# Altium project TIDA-010954-RevB.PrjPcb (part 2 of 6)

## Sheet TIDA-010954-Input.SchDoc
size 431 x 279 mm; Date: Not shown in title block; ApprovedBy: Not shown in title block; CheckedBy: Not shown in title block; Author: Not shown in title block; CompanyName: Not shown in title block; Engineer: Not shown in title block; Organization: Not shown in title block; Address1: Not shown in title block; Address2: Not shown in title block; Address3: Not shown in title block; Address4: Not shown in title block; DocumentNumber: 2; Revision: Use project parameter SCH_Rev; SheetNumber: 5; SheetTotal: 9; PageSetup: Record=PageOptions|CenterHorizontal=True|CenterVertical=True|PrintScale=1.00|XCorrection=1.00|YCorrection=1.00|PrintKind=0|BorderSize=5000000|LeftOffset=0|BottomOffset=0|Orientation=2|PaperLength=1000|PaperWidth=1000|Scale=100|PaperSource=15|PrintQuality=600|MediaType=1|DitherType=10|PaperKind=Letter|PrintScaleMode=1; CurrentTime: Not shown in title block; CurrentDate: Not shown in title block; Time: Not shown in title block; DocumentFullPathAndName: Not shown in title block; DocumentName: Not shown in title block; ModifiedDate: 1/25/2022; ImagePath: Not shown in title block
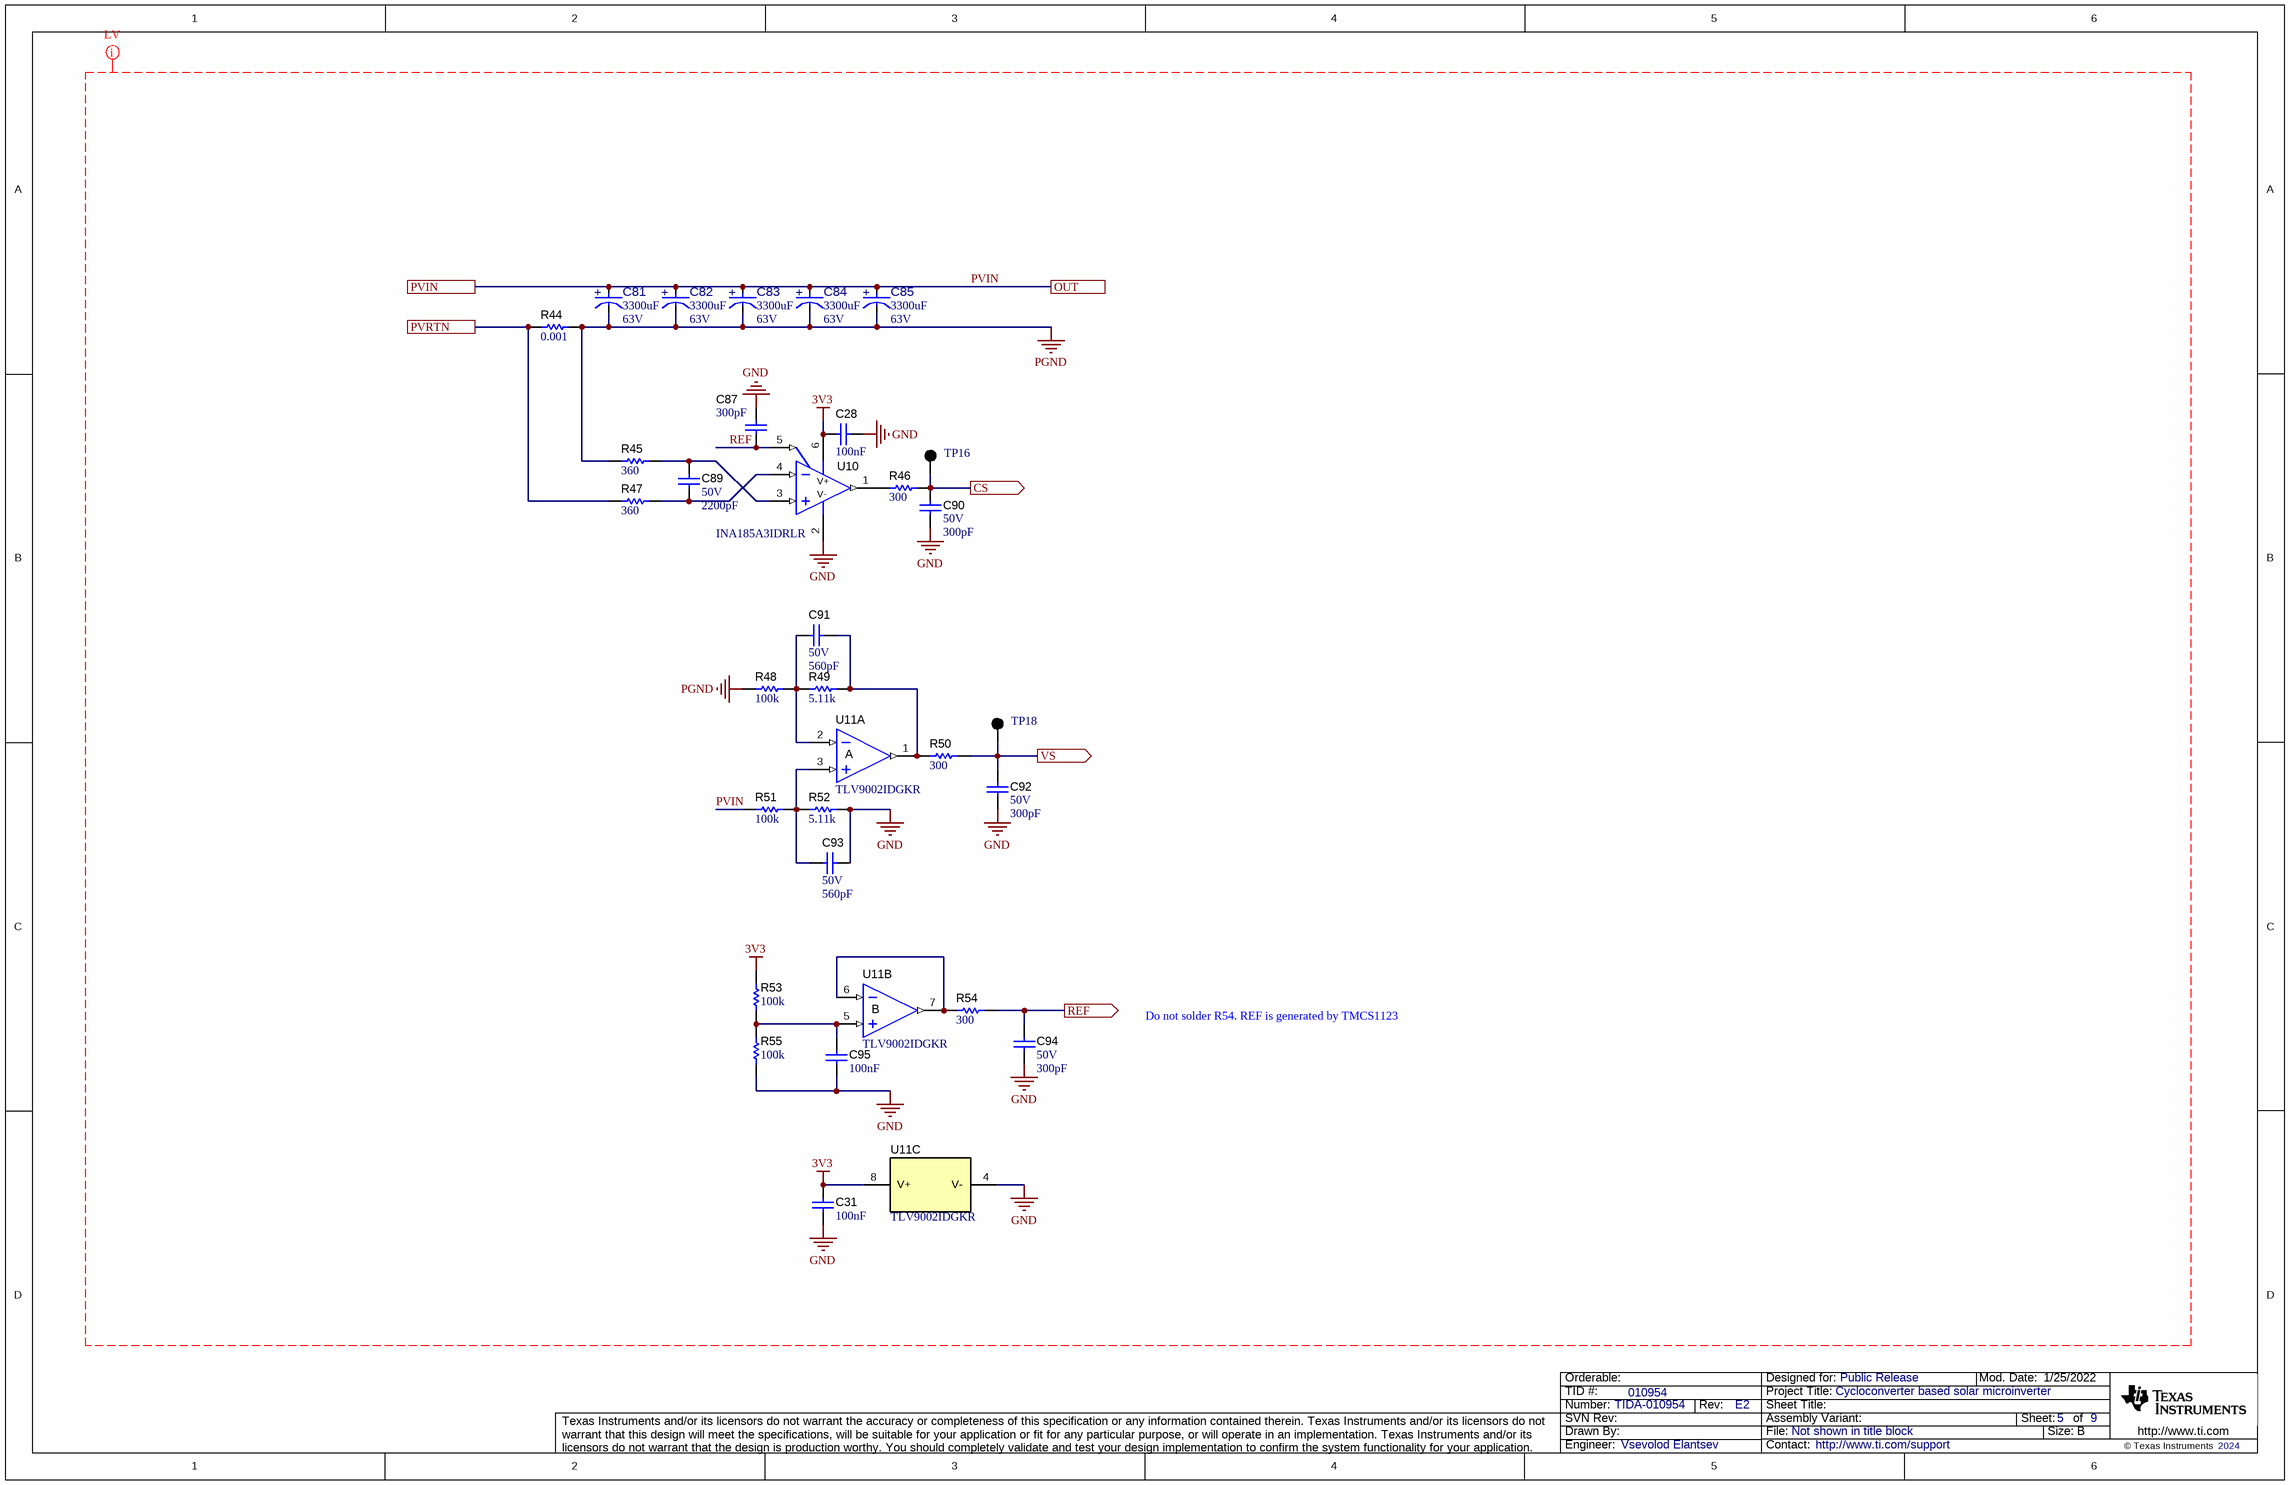
[diagram p2: TIDA-010954-Input.SchDoc]

### Parts
C28  Cap_F: 100nF  [0603]  (hidden comment: CGA3E2X7R1E104K080AA)
C31  Cap_F: 100nF  [0603]  (hidden comment: CGA3E2X7R1E104K080AA)
C81  ValueDisplayed: 3300uF  VDC_V: 63V  [FP-63ZLJ2700M18X40_RADIAL-MFG]  (hidden comment: 63ZLJ2700M18X40)
C82  ValueDisplayed: 3300uF  VDC_V: 63V  [FP-63ZLJ2700M18X40_RADIAL-MFG]  (hidden comment: 63ZLJ2700M18X40)
C83  ValueDisplayed: 3300uF  VDC_V: 63V  [FP-63ZLJ2700M18X40_RADIAL-MFG]  (hidden comment: 63ZLJ2700M18X40)
C84  ValueDisplayed: 3300uF  VDC_V: 63V  [FP-63ZLJ2700M18X40_RADIAL-MFG]  (hidden comment: 63ZLJ2700M18X40)
C85  ValueDisplayed: 3300uF  VDC_V: 63V  [FP-63ZLJ2700M18X40_RADIAL-MFG]  (hidden comment: 63ZLJ2700M18X40)
C87  ValueDisplayed: 300pF  [0603]  (hidden comment: GRM1885C1H301JA01D)
C89  VDC_V: 50V  ValueDisplayed: 2200pF  [0603]  (hidden comment: GRM1885C1H222JA01D)
C90  VDC_V: 50V  ValueDisplayed: 300pF  [0603]  (hidden comment: GRM1885C1H301JA01D)
C91  VDC_V: 50V  ValueDisplayed: 560pF  [0603]  (hidden comment: GRM1885C1H561JA01D)
C92  VDC_V: 50V  ValueDisplayed: 300pF  [0603]  (hidden comment: GRM1885C1H301JA01D)
C93  VDC_V: 50V  ValueDisplayed: 560pF  [0603]  (hidden comment: GRM1885C1H561JA01D)
C94  VDC_V: 50V  ValueDisplayed: 300pF  [0603]  (hidden comment: GRM1885C1H301JA01D)
C95  Cap_F: 100nF  [0603]  (hidden comment: CGA3E2X7R1E104K080AA)
R44  ValueDisplayed: 0.001  [1206]  (hidden comment: CRF1206-FZ-R001ELF)
R45  ValueDisplayed: 360  [0603]  (hidden comment: RC0603JR-07360RL)
R46  ValueDisplayed: 300  [0603]  (hidden comment: RC0603FR-07300RL)
R47  ValueDisplayed: 360  [0603]  (hidden comment: RC0603JR-07360RL)
R48  ValueDisplayed: 100k  [0603]  (hidden comment: RT0603BRD07100KL)
R49  ValueDisplayed: 5.11k  [0603]  (hidden comment: RT0603BRD075K11L)
R50  ValueDisplayed: 300  [0603]  (hidden comment: RC0603FR-07300RL)
R51  ValueDisplayed: 100k  [0805_HV]  (hidden comment: RT0805BRD07100KL)
R52  ValueDisplayed: 5.11k  [0603]  (hidden comment: RT0603BRD075K11L)
R53  ValueDisplayed: 100k  [0603]  (hidden comment: RT0603BRD07100KL)
R54  ValueDisplayed: 300  [0603]  (hidden comment: RC0603FR-07300RL)
R55  ValueDisplayed: 100k  [0603]  (hidden comment: RT0603BRD07100KL)
TP16  5011  [Keystone5011]  (value not drawn)
TP18  5011  [Keystone5011]  (value not drawn)
U10  INA185A3IDRLR  [DRL0006A]
U11  TLV9002IDGKR  [DGK0008A_N]  (parts A,B,C of 3)

### Ports
CS (out), OUT, PVIN, PVRTN, REF (out), VS (out)

### Nets
3V3: C28.1 C31.2 R53.1 U10.6(V+) U11.8(V+)
GND: C28.2 C31.1 C87.2 C90.2 C92.2 C93.1 C94.2 C95.1 R52.2 R55.2 U10.2(V-) U11.4(V-)
PGND: C81.1(CATHODE) C82.1(CATHODE) C83.1(CATHODE) C84.1(CATHODE) C85.1(CATHODE) R44.2 R45.1 R48.1
DC_CS: C90.1 R46.1 TP16.1 ; port CS
DC_VS: C92.1 R50.1 TP18.1 ; port VS
PVIN: C81.2(ANODE) C82.2(ANODE) C83.2(ANODE) C84.2(ANODE) C85.2(ANODE) R51.1 ; port PVIN, port OUT
PVRTN: R44.1 R47.1 ; port PVRTN
REF: C94.1 R54.1 ; port REF
REF: C87.1 U10.5(REF)  [a separate net that carries the same name]
NetC89_1: C89.1 R45.2 U10.3(IN+)
NetC89_2: C89.2 R47.2 U10.4(IN-)
NetC91_1: C91.1 R49.2 R50.2 U11.1(OUT)
NetC91_2: C91.2 R48.2 R49.1 U11.2(IN-)
NetC93_2: C93.2 R51.2 R52.1 U11.3(IN+)
NetC95_2: C95.2 R53.2 R55.1 U11.5(IN+)
NetR46_2: R46.2 U10.1(OUT)
NetR54_2: R54.2 U11.6(IN-) U11.7(OUT)

### Layout directives
net class LV: 3V3, GND, PGND, PVIN, REF

### Notes on the sheet
- Do not solder R54. REF is generated by TMCS1123
- Drawn By:
- SVN Rev:
- Number:
- TID #:
- Orderable:
- Rev:
- Sheet Title:
- File:
- Project Title:
- Designed for:
- Assembly Variant:
- Mod. Date:
- Sheet:
- Size:
- of
- B
- http://www.ti.com
- Texas Instruments and/or its licensors do not warrant the accuracy or completeness of this specification or any information contained therein. Texas Instruments and/or its licensors do not warrant that this design will meet the specifications, will be suitable for your application or fit for any particular purpose, or will operate in an implementation. Texas Instruments and/or its licensors do not warrant that the design is production worthy. You should completely validate and test your design implementation to confirm the system functionality for your application.
- Engineer:
- Contact:
- © Texas Instruments
- (in symbol CMP-0073533-3, part A) A
- (in symbol CMP-0073533-3, part B) B
- (in symbol CMP-0122849-1) +

### Library data of the parts
C28 C31 C95 = CMP-0007077-5: as C45 on sheet TIDA-010954-Power; Supplier Part Number 2: 79Y4100; Publisher: Texas Instruments; Supplier 2: Newark; Supplier Part Number 3: 810-CGA3E2X7R1E104K; TempCo: X7R; Supplier 3: Mouser; Published: 2008-06-19; RoHS: Y; MountType: SMT; Supplier 1: Digi-Key; PackageReference: 0603; Tolerance_%: 10%; Cap_Case: 0603; CompType: Capacitor; LatestRevisionDate: 2017-03-09; PartNumber: CGA3E2X7R1E104K080AA; VDC_V: 25V; ComponentLink1Description: Datasheet link; AEC Grade: 1; Supplier Part Number 1: 445-5667-1-ND; Technology: Ceramic; ValueDisplayed: 0.1uF; ComponentLink1URL: https://product.tdk.com/info/en/documents/chara_sheet/CGA3E2X7R1E104K080AA.pdf
C81-C85 = CMP-0122849-1: 2700 µF 63 V Aluminum Electrolytic Capacitors Radial, Can 10000 Hrs @ 105°C; Manufacturer: Rubycon; Part Number: 63PK3300MEFC18X40; AEC Qualified: No; Cap_F: 2.7mF; IRMS_A: 4.3A; SizeZ_mm: 42mm; Tolerance_%: 20%; Dissipation Factor: 9%; Leakage Current: 1701uA; Life: 10000Hours; Value: 2.7mF; PackageReference: RADIAL; PartNumber: 63ZLJ2700M18X40; RoHS: TRUE; Supplier 1: Digikey; Supplier 2: Mouser; Supplier Part Number 1: 1189-4111-ND; Supplier Part Number 2: 232-63ZLJ2700M18X40; datasheet: https://www.rubycon.co.jp/wp-content/uploads/catalog-aluminum/ZLJ.pdf; Datasheet Path: datasheets/Cap-63ZLJ2700M18X40.pdf; Digikey Description: CAP ALUM 2700UF 20% 63V RADIAL; Digikey Part Number: 1189-4111-ND; helpURL: https://upverter.com/upn/revision/aed06e7c5360b1c1/; Lead Free: Yes; Mouser Part Number: 232-63ZLJ2700M18X40; Operating Temperature Range: -40°C to +105°C; ComponentLink1Description: Datasheet; ComponentLink1URL: https://www.rubycon.co.jp/wp-content/uploads/catalog-aluminum/ZLJ.pdf
C87 = CMP-0007206-4: CAP, CERM, 300 pF, 50 V, +/- 5%, C0G/NP0, 0603; Manufacturer: MuRata; TaMin_C: -55°C; Polarized: N; SizeAreaWB_mm2: 4.68; Value1: Unknown; U/M: EA; Value: 300pF; TaMax_C: 125°C; SizeZ_mm: 1; SizeX_mm: 1.6; SizeY_mm: 0.8; Value2: 50V; SizeArea_mm2: 1.28; AEC Category: Q200; Supplier Part Number 2: 81-GRM185C1H301JA01D; Publisher: Texas Instruments; Supplier 2: Mouser; TempCo: C0G/NP0; Published: 2008-06-19; RoHS: Y; MountType: SMT; Supplier 1: Digi-Key; PackageReference: 0603; Tolerance_%: 5%; Cap_Case: 0603; CompType: Capacitor; LatestRevisionDate: 2017-03-09; PartNumber: GRM1885C1H301JA01D; AEC Qualified: ?; Cap_F: 300pF; VDC_V: 50V; ComponentLink1Description: Datasheet link; Supplier Part Number 1: 490-1438-1-ND; Technology: Ceramic; ComponentLink1URL: http://search.murata.co.jp/Ceramy/PnsearchViewAction.do?HnOFG=ON&HnNFG=ON&SEL_CNT=50&sLang=en&sKey=GRM1885C1H301JA01D&x=9&y=9&search=startwith
C89 = CMP-0007198-4: CAP, CERM, 2200 pF, 50 V, +/- 5%, C0G/NP0, 0603; Manufacturer: MuRata; TaMin_C: -55°C; Polarized: N; SizeAreaWB_mm2: 4.68; Value1: Unknown; U/M: EA; Value: 2200pF; TaMax_C: 125°C; SizeZ_mm: 1; SizeX_mm: 1.6; SizeY_mm: 0.8; SizeArea_mm2: 1.28; Cap_F: 2.2nF; AEC Category: Q200; Supplier Part Number 2: 81-GRM1885C1H222JA01; Publisher: Texas Instruments; Supplier 2: Mouser; Supplier Part Number 3: 8819947; TempCo: C0G/NP0; Supplier 3: Farnell; Published: 2008-06-19; RoHS: Y; MountType: SMT; Supplier 1: Digi-Key; PackageReference: 0603; Tolerance_%: 5%; Cap_Case: 0603; Value2: 50V; CompType: Capacitor; LatestRevisionDate: 2017-03-09; PartNumber: GRM1885C1H222JA01D; AEC Qualified: ?; ComponentLink1Description: Datasheet link; Supplier Part Number 1: 490-1459-1-ND; Technology: Ceramic; ComponentLink1URL: http://search.murata.co.jp/Ceramy/PnsearchViewAction.do?HnOFG=ON&HnNFG=ON&SEL_CNT=50&sLang=en&sKey=GRM1885C1H222JA01D&x=9&y=9&search=startwith
C90 C92 C94 = CMP-0007206-4: CAP, CERM, 300 pF, 50 V, +/- 5%, C0G/NP0, 0603; Manufacturer: MuRata; TaMin_C: -55°C; Polarized: N; SizeAreaWB_mm2: 4.68; Value1: Unknown; U/M: EA; Value: 300pF; TaMax_C: 125°C; SizeZ_mm: 1; SizeX_mm: 1.6; SizeY_mm: 0.8; SizeArea_mm2: 1.28; AEC Category: Q200; Supplier Part Number 2: 81-GRM185C1H301JA01D; Publisher: Texas Instruments; Supplier 2: Mouser; TempCo: C0G/NP0; Published: 2008-06-19; RoHS: Y; MountType: SMT; Supplier 1: Digi-Key; PackageReference: 0603; Tolerance_%: 5%; Cap_Case: 0603; Value2: 50V; CompType: Capacitor; LatestRevisionDate: 2017-03-09; PartNumber: GRM1885C1H301JA01D; AEC Qualified: ?; Cap_F: 300pF; ComponentLink1Description: Datasheet link; Supplier Part Number 1: 490-1438-1-ND; Technology: Ceramic; ComponentLink1URL: http://search.murata.co.jp/Ceramy/PnsearchViewAction.do?HnOFG=ON&HnNFG=ON&SEL_CNT=50&sLang=en&sKey=GRM1885C1H301JA01D&x=9&y=9&search=startwith
C91 C93 = CMP-0007225-4: CAP, CERM, 560 pF, 50 V, +/- 5%, C0G/NP0, 0603; Manufacturer: MuRata; TaMin_C: -55°C; Polarized: N; SizeAreaWB_mm2: 4.68; Value1: Unknown; U/M: EA; Value: 560pF; TaMax_C: 125°C; SizeZ_mm: 1; SizeX_mm: 1.6; SizeY_mm: 0.8; SizeArea_mm2: 1.28; AEC Category: Q200; Supplier Part Number 2: 81-GRM39C561J50; Publisher: Texas Instruments; Supplier 2: Mouser; Supplier Part Number 3: 1828912; TempCo: C0G/NP0; Supplier 3: Farnell; Published: 2008-06-19; RoHS: Y; MountType: SMT; Supplier 1: Digi-Key; PackageReference: 0603; Tolerance_%: 5%; Cap_Case: 0603; Value2: 50V; CompType: Capacitor; LatestRevisionDate: 2017-03-09; PartNumber: GRM1885C1H561JA01D; AEC Qualified: ?; Cap_F: 560pF; ComponentLink1Description: Datasheet link; Supplier Part Number 1: 490-1445-1-ND; Technology: Ceramic; ComponentLink1URL: http://search.murata.co.jp/Ceramy/PnsearchViewAction.do?HnOFG=ON&HnNFG=ON&SEL_CNT=50&sLang=en&sKey=GRM1885C1H561JA01D&x=9&y=9&search=startwith
R44 = CMP-0078821-1: RES, 0.001, 1%, 1 W, AEC-Q200 Grade 0, 1206; Manufacturer: Bourns; Value_Code: 1L000; SizeArea_mm2: 5.12; AEC Qualified: Y; AEC Category: Q200; Res_ohm: 1m; Value: 0.001; SizeZ_mm: 1.35; EIA_Code: E96; TempCo: 50 ppm/C; AEC Grade: 0; SizeY_mm: 1.6; Power_W: 1W; SizeX_mm: 3.2; ComponentLink1Description: Datasheet link; RoHS: Y; Tolerance_%: 1%; PackageReference: 1206; Technology: Metal Film; PartNumber: CRF1206-FZ-R001ELF; Value2: 1W; ComponentLink1URL: http://www.bourns.com/docs/Product-Datasheets/crf.pdf; Value1: 1%; CompType: Resistor; MountType: SMT
R45 R47 = CMP-0025914-5: RES, 360, 5%, 0.1 W, 0603; Manufacturer: Yageo; Power_W: 100mW; TempCo: 100 ppm/C; Value_Code: 360R; Value: 360; EIA_Code: E24; SizeX_mm: 1.6; SizeY_mm: 0.8; SizeZ_mm: 1; Value2: 0.1W; SizeArea_mm2: 1.28; AEC Qualified: N; VDC_V: 75V; AEC Category: Q200; SizeAreaWB_mm2: 4.68; Supplier Part Number 2: 603-RC0603JR-07360RL; Supplier 2: Mouser; RoHS: Y; Value1: 5%; MountType: SMT; Supplier 1: Digi-Key; PackageReference: 0603; Tolerance_%: 5%; Res_ohm: 360; CompType: Resistor; PartNumber: RC0603JR-07360RL; ComponentLink1Description: Datasheet link; Supplier Part Number 1: 311-360GRCT-ND; Technology: Thick Film; ComponentLink1URL: http://www.yageo.com/pdf/Pu-RC0603_51_PbFree_L_2.pdf; AEC Grade: N/A
R46 R50 R54 = CMP-0023013-5: RES, 300, 1%, 0.1 W, 0603; Manufacturer: Yageo; Power_W: 100mW; TempCo: 100 ppm/C; Value_Code: 300R; Value: 300; SizeX_mm: 1.6; SizeY_mm: 0.8; SizeZ_mm: 1; Value2: 0.1W; SizeArea_mm2: 1.28; AEC Qualified: N; VDC_V: 75V; AEC Category: Q200; SizeAreaWB_mm2: 4.68; Supplier Part Number 2: 603-RC0603FR-07300RL; Supplier 2: Mouser; Supplier Part Number 3: 1799340; Supplier 3: Farnell; RoHS: Y; Value1: 1%; MountType: SMT; Supplier 1: Digi-Key; PackageReference: 0603; Tolerance_%: 1%; Res_ohm: 300; CompType: Resistor; PartNumber: RC0603FR-07300RL; ComponentLink1Description: Datasheet link; Supplier Part Number 1: 311-300HRCT-ND; Technology: Thick Film; ComponentLink1URL: http://www.yageo.com/pdf/Pu-RC0603_51_PbFree_L_2.pdf; AEC Grade: N/A
R48 R53 R55 = CMP-0023630-3: RES, 100 k, 0.1%, 0.1 W, 0603; Manufacturer: Yageo America; Power_W: 100mW; TempCo: 25 ppm/C; U/M: EA; Value: 100k; EIA_Code: E192; SizeX_mm: 1.6; SizeY_mm: 0.8; SizeZ_mm: 1; Value2: 0.1W; SizeArea_mm2: 1.28; VDC_V: 75V; AEC Category: Q200; Publisher: Texas Instruments; Published: 2008-06-26; Value_Code: 100k; RoHS: Y; Value1: 0.1%; MountType: SMT; Supplier 1: Mouser; PackageReference: 0603; Tolerance_%: 0.1%; Res_ohm: 100k; CompType: Resistor; LatestRevisionDate: 2017-03-09; PartNumber: RT0603BRD07100KL; AEC Qualified: ?; ComponentLink1Description: Datasheet link; Supplier Part Number 1: 603-RT0603BRD07100KL; Technology: Thin Film; ComponentLink1URL: http://www.yageo.com/pdf/PYu-RT_1-to-0.05_RoHS_L_3.pdf
R49 R52 = CMP-0024366-2: RES, 5.11 k, 0.1%, 0.1 W, 0603; Manufacturer: Yageo America; Power_W: 100mW; TempCo: 25 ppm/C; Value_Code: 5k11; U/M: EA; Value: 5.11k; EIA_Code: E192; SizeX_mm: 1.6; SizeY_mm: 0.8; SizeZ_mm: 1; Value2: 0.1W; SizeArea_mm2: 1.28; VDC_V: 75V; AEC Category: Q200; ComponentLink1URL: http://www.yageo.com/pdf/PYu-RT_1-to-0.05_RoHS_L_3.pdf; Publisher: Texas Instruments; Published: 2008-06-26; RoHS: Y; Value1: 0.1%; MountType: SMT; PackageReference: 0603; Tolerance_%: 0.1%; Res_ohm: 5.11k; CompType: Resistor; LatestRevisionDate: 2017-03-09; PartNumber: RT0603BRD075K11L; AEC Qualified: ?; ComponentLink1Description: Datasheet link; Technology: Thin Film
R51 = CMP-0019441-2: RES, 100 k, 0.1%, 0.125 W, 0805; Manufacturer: Yageo America; Power_W: 125mW; TempCo: 25 ppm/C; U/M: EA; Value: 100k; EIA_Code: E192; SizeX_mm: 2; SizeY_mm: 1.25; SizeZ_mm: 1.45; Value2: 0.125W; SizeArea_mm2: 2.5; VDC_V: 150V; AEC Category: Q200; Publisher: Texas Instruments; Published: 2008-06-26; Value_Code: 100k; RoHS: Y; Value1: 0.1%; MountType: SMT; PackageReference: 0805; Tolerance_%: 0.1%; Res_ohm: 100k; CompType: Resistor; LatestRevisionDate: 2017-03-09; PartNumber: RT0805BRD07100KL; AEC Qualified: ?; ComponentLink1Description: Datasheet link; Technology: Thin Film; ComponentLink1URL: http://www.yageo.com/pdf/PYu-RT_1-to-0.05_RoHS_L_3.pdf
TP16 TP18 = CMP-0055148-2: as TP4 on sheet TIDA-010954-Top; ComponentLink1Description: Datasheet URL; Supplier 1: Digi-Key; MountType: TH; Supplier 2: Mouser; LatestRevisionDate: 26/05/2017; Publisher: Texas Instruments; PartNumber: 5011; Color: Black; ComponentLink1URL: http://www.keyelco.com/userAssets/file/M60-2p60.pdf; Green_EU RoHS-2: Incomplete; Supplier Part Number 1: 36-5011-ND; Supplier Part Number 2: 534-5011; Green_EU RoHS: Passed; RoHS: Y; PackageReference: Black Multipurpose Testpoint; CompType: Test Point
U10 = CMP-0085240-1: Bidirectional, Precision Low- and High-Side Voltage Output, Current-Sense Amplifier, DRL0006A (SOT-5X3-6); Alternate Manufacturer: Texas Instruments; Alternate PartNumber: INA185A3IDRLT; SizeAreaWB_mm2: 6.76; SizeY_mm: 1.6; CompType: IC; SizeZ_mm: 0.6; AEC Category: Q200; SizeArea_mm2: 2.56; AEC Qualified: N; ComponentLink2URL: http://www.ti.com/product/ina185; MountType: SMT; ComponentLink1URL: http://www.ti.com/lit/ds/symlink/ina185.pdf; ComponentLink3Description: Online Datasheet; ComponentLink1Description: Datasheet Link; ComponentLink2Description: Product Folder; Manufacturer: Texas Instruments; PackageReference: DRL0006A; PartNumber: INA185A3IDRLR; ComponentLink3URL: http://www.ti.com/product/ina185/datasheet; SizeX_mm: 1.6; PackageDescription: SOT-5X3-6
U11 = CMP-0073533-3: Alternate PartNumber: TLV2333IDGKT; Alternate Manufacturer: Texas Instruments; SizeAreaWB_mm2: 23.6; SizeZ_mm: 1.1; SizeX_mm: 4.9; SizeY_mm: 3; SizeArea_mm2: 14.7; CompType: IC; AEC Category: Q200; AEC Qualified: N; ComponentLink1URL: http://www.ti.com/lit/ds/symlink/tlv2333.pdf; PackageDescription: VSSOP-8; RoHS: Y; MountType: SMT; Manufacturer: Texas Instruments; PackageReference: DGK0008A; PartNumber: TLV9002IDGKR; ComponentLink1Description: Datasheet Link; ComponentLink2Description: Product Folder; ComponentLink2URL: http://www.ti.com/product/tlv2333; ComponentLink3Description: Online Datasheet; ComponentLink3URL: http://www.ti.com/product/tlv2333/datasheet; Code_JEDEC: MO-187-AA

## Sheet TIDA-010954-Output.SchDoc
size 431 x 279 mm; Date: Not shown in title block; ApprovedBy: Not shown in title block; CheckedBy: Not shown in title block; Author: Not shown in title block; CompanyName: Not shown in title block; Engineer: Not shown in title block; Organization: Not shown in title block; Address1: Not shown in title block; Address2: Not shown in title block; Address3: Not shown in title block; Address4: Not shown in title block; DocumentNumber: 2; Revision: Use project parameter SCH_Rev; SheetNumber: 7; SheetTotal: 9; PageSetup: Record=PageOptions|CenterHorizontal=True|CenterVertical=True|PrintScale=1.00|XCorrection=1.00|YCorrection=1.00|PrintKind=0|BorderSize=5000000|LeftOffset=0|BottomOffset=0|Orientation=2|PaperLength=1000|PaperWidth=1000|Scale=100|PaperSource=15|PrintQuality=600|MediaType=1|DitherType=10|PaperKind=Letter|PrintScaleMode=1; CurrentTime: Not shown in title block; CurrentDate: Not shown in title block; Time: Not shown in title block; DocumentFullPathAndName: Not shown in title block; DocumentName: Not shown in title block; ModifiedDate: 1/25/2022; ImagePath: Not shown in title block
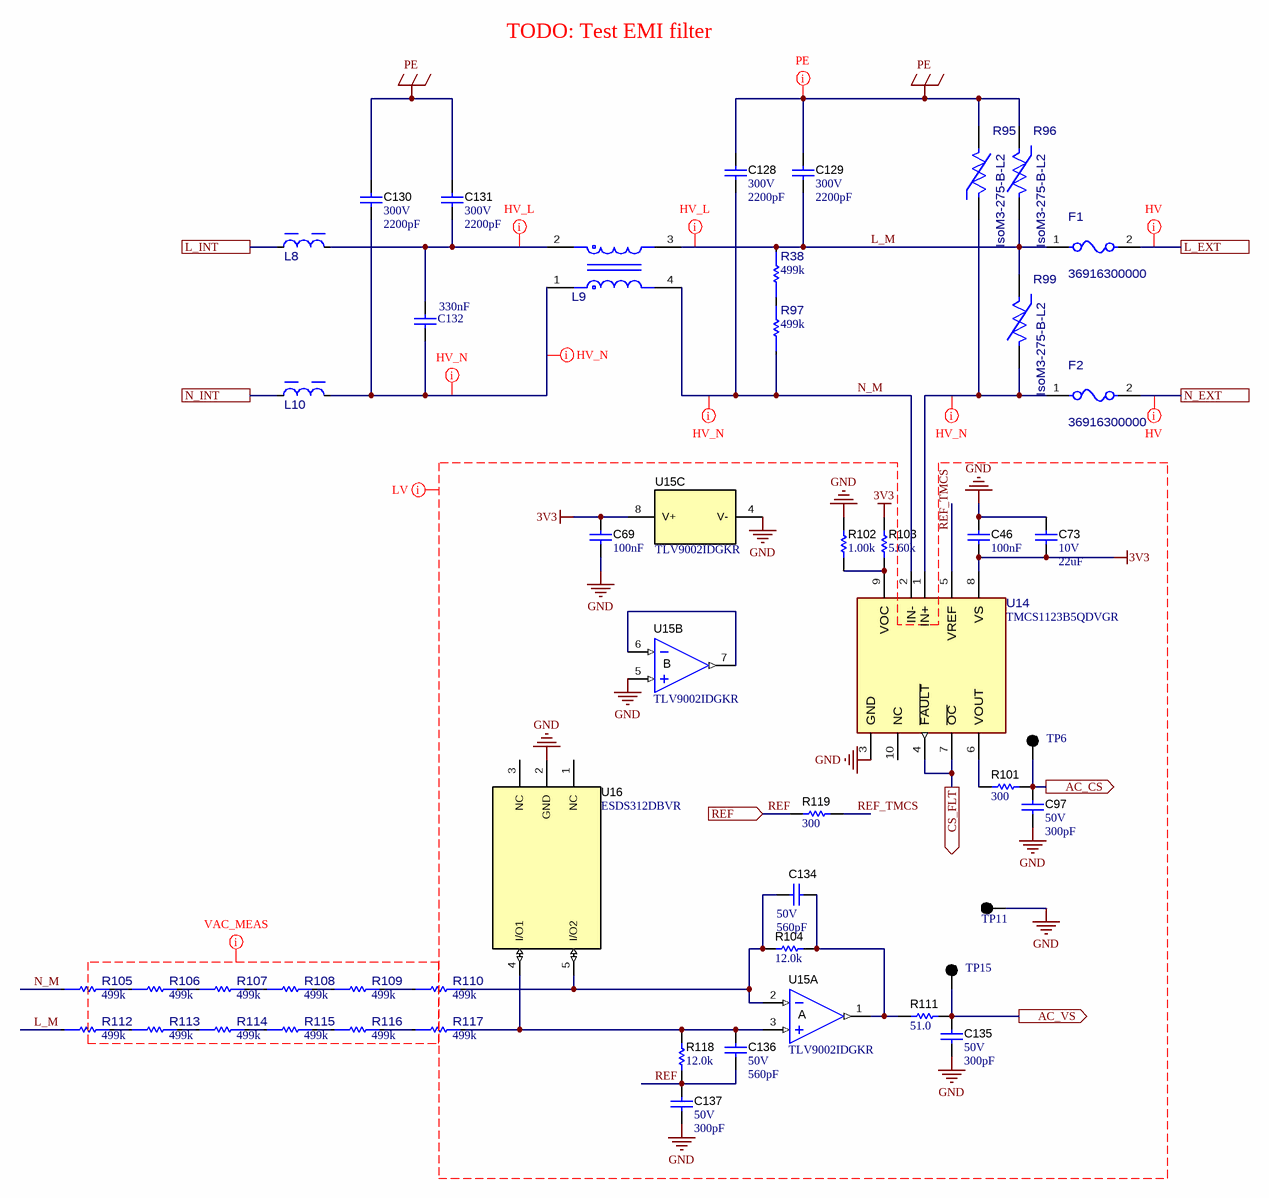
[diagram p3: TIDA-010954-Output.SchDoc]

### Parts
C46  Cap_F: 100nF  [0603]  (hidden comment: CGA3E2X7R1E104K080AA)
C69  Cap_F: 100nF  [0603]  (hidden comment: CGA3E2X7R1E104K080AA)
C73  VDC_V: 10V  ValueDisplayed: 22uF  [1206_180]  (hidden comment: GRM31CR71A226KE15L)
C97  VDC_V: 50V  ValueDisplayed: 300pF  [0603]  (hidden comment: GRM1885C1H301JA01D)
C128  VDC_V: 300V  ValueDisplayed: 2200pF  [E_900x700x900]  (hidden comment: DE6E3KJ222MN3A)
C129  VDC_V: 300V  ValueDisplayed: 2200pF  [E_900x700x900]  (hidden comment: DE6E3KJ222MN3A)
C130  VDC_V: 300V  ValueDisplayed: 2200pF  [E_900x700x900]  (hidden comment: DE6E3KJ222MN3A)
C131  VDC_V: 300V  ValueDisplayed: 2200pF  [E_900x700x900]  (hidden comment: DE6E3KJ222MN3A)
C132  Cap_F: 330nF  [WCAP-FTX2_L18W8.5H14.5_CS]  (hidden comment: 890324025034CS)
C134  VDC_V: 50V  ValueDisplayed: 560pF  [0603]  (hidden comment: GRM1885C1H561JA01D)
C135  VDC_V: 50V  ValueDisplayed: 300pF  [0603]  (hidden comment: GRM1885C1H301JA01D)
C136  VDC_V: 50V  ValueDisplayed: 560pF  [0603]  (hidden comment: GRM1885C1H561JA01D)
C137  VDC_V: 50V  ValueDisplayed: 300pF  [0603]  (hidden comment: GRM1885C1H301JA01D)
F1  36916300000  [FP-36916300000_RADIAL-MFG]
F2  36916300000  [FP-36916300000_RADIAL-MFG]
L8  7443551221  [FP-7443551221_SMD_IND_12MM8_12MM8-MFG]  (value not drawn)
L9  7448025003  [FP-7448025003_PTH_COMMON_CHOKE-MFG]  (value not drawn)
L10  7443551221  [FP-7443551221_SMD_IND_12MM8_12MM8-MFG]  (value not drawn)
R38  value 499k  [FP-ERJP08D4993V_1206-MFG]  (hidden comment: ERJP08D4993V)
R95  IsoM3-275-B-L2  [FP-IsoM3-275-B-L2_RADIAL-MFG]
R96  IsoM3-275-B-L2  [FP-IsoM3-275-B-L2_RADIAL-MFG]
R97  value 499k  [FP-ERJP08D4993V_1206-MFG]  (hidden comment: ERJP08D4993V)
R99  IsoM3-275-B-L2  [FP-IsoM3-275-B-L2_RADIAL-MFG]
R101  ValueDisplayed: 300  [0603]  (hidden comment: RC0603FR-07300RL)
R102  ValueDisplayed: 1.00k  [0603]  (hidden comment: RC0603FR-071KL)
R103  ValueDisplayed: 5.60k  [0603]  (hidden comment: RC0603FR-075K6L)
R104  ValueDisplayed: 12.0k  [0603]  (hidden comment: RT0603BRD0712KL)
R105  value 499k  [FP-ERJP08D4993V_1206-MFG]  (hidden comment: ERJP08D4993V)
R106  value 499k  [FP-ERJP08D4993V_1206-MFG]  (hidden comment: ERJP08D4993V)
R107  value 499k  [FP-ERJP08D4993V_1206-MFG]  (hidden comment: ERJP08D4993V)
R108  value 499k  [FP-ERJP08D4993V_1206-MFG]  (hidden comment: ERJP08D4993V)
R109  value 499k  [FP-ERJP08D4993V_1206-MFG]  (hidden comment: ERJP08D4993V)
R110  value 499k  [FP-ERJP08D4993V_1206-MFG]  (hidden comment: ERJP08D4993V)
R111  ValueDisplayed: 51.0  [0603]  (hidden comment: RC0603FR-0751RL)
R112  value 499k  [FP-ERJP08D4993V_1206-MFG]  (hidden comment: ERJP08D4993V)
R113  value 499k  [FP-ERJP08D4993V_1206-MFG]  (hidden comment: ERJP08D4993V)
R114  value 499k  [FP-ERJP08D4993V_1206-MFG]  (hidden comment: ERJP08D4993V)
R115  value 499k  [FP-ERJP08D4993V_1206-MFG]  (hidden comment: ERJP08D4993V)
R116  value 499k  [FP-ERJP08D4993V_1206-MFG]  (hidden comment: ERJP08D4993V)
R117  value 499k  [FP-ERJP08D4993V_1206-MFG]  (hidden comment: ERJP08D4993V)
R118  ValueDisplayed: 12.0k  [0603]  (hidden comment: RT0603BRD0712KL)
R119  ValueDisplayed: 300  [0603]  (hidden comment: RC0603FR-07300RL)
TP6  5011  [Keystone5011]  (value not drawn)
TP11  5011  [Keystone5011]  (value not drawn)
TP15  5011  [Keystone5011]  (value not drawn)
U14  TMCS1123B5QDVGR  [DVG0010A-MFG]
U15  TLV9002IDGKR  [DGK0008A_N]  (parts A,B,C of 3)
U16  ESDS312DBVR  [DBV0005A_N]

### Ports
AC_CS (out), AC_VS (out), CS_FLT (out), L_EXT, L_INT, N_EXT, N_INT, REF (in)

### Nets
3V3: C46.1 C69.2 C73.2 R103.1 U14.8(VS) U15.8(V+)
GND: C46.2 C69.1 C73.1 C97.2 C135.2 C137.2 R102.1 TP11.1 U14.3(GND) U15.4(V-) U15.5(IN+) U16.2(GND)
PE: C128.2 C129.1 C130.1 C131.2 R95.1 R96.2
AC_CS: C97.1 R101.1 TP6.1 ; port AC_CS
AC_CS_FLT: U14.4(~{FAULT}) U14.7(~{OC}) ; port CS_FLT
AC_VS: C135.1 R111.2 TP15.1 ; port AC_VS
DA: L8.1 ; port L_INT
DB: L10.1 ; port N_INT
L_EXT: F1.2 ; port L_EXT
L_M: C129.2 F1.1 L9.3 R38.2 R96.1 R99.2 R112.1
N_EXT: F2.2 ; port N_EXT
N_M: C128.1 L9.4 R97.1 R105.1 U14.2(IN-)
REF: C136.2 C137.1 R118.1 R119.2 ; port REF
REF_TMCS: R119.1 U14.5(VREF)
NetC130_2: C130.2 C132.1 L9.1 L10.2
NetC131_1: C131.1 C132.2 L8.2 L9.2
NetC134_1: C134.1 R104.1 R111.1 U15.1(OUT)
NetC134_2: C134.2 R104.2 R110.2 U15.2(IN-) U16.5(I/O2)
NetC136_1: C136.1 R117.2 R118.2 U15.3(IN+) U16.4(I/O1)
NetF2_1: F2.1 R95.2 R99.1 U14.1(IN+)
NetR38_1: R38.1 R97.2
NetR101_2: R101.2 U14.6(VOUT)
NetR102_2: R102.2 R103.2 U14.9(VOC)
NetR105_2: R105.2 R106.1
NetR106_2: R106.2 R107.1
NetR107_2: R107.2 R108.1
NetR108_2: R108.2 R109.1
NetR109_2: R109.2 R110.1
NetR112_2: R112.2 R113.1
NetR113_2: R113.2 R114.1
NetR114_2: R114.2 R115.1
NetR115_2: R115.2 R116.1
NetR116_2: R116.2 R117.1
NetU15_6: U15.6(IN-) U15.7(OUT)

Not connected (* = marked no-connect by the designer): U14 10(NC); U16 1(NC) 3(NC)

### Layout directives
net class HV_N: N_M, NetC130_2, NetF2_1
net class HV_L: L_M, NetC131_1
net class HV: L_EXT, N_EXT
net class PE: PE
net class LV: 3V3, GND, REF, REF_TMCS
net class VAC_MEASURE: (no net found under the mark)

### Notes on the sheet
- TODO: Test EMI filter
- Drawn By:
- SVN Rev:
- Number:
- TID #:
- Orderable:
- Rev:
- Sheet Title:
- File:
- Project Title:
- Designed for:
- Assembly Variant:
- Mod. Date:
- Sheet:
- Size:
- of
- B
- http://www.ti.com
- Texas Instruments and/or its licensors do not warrant the accuracy or completeness of this specification or any information contained therein. Texas Instruments and/or its licensors do not warrant that this design will meet the specifications, will be suitable for your application or fit for any particular purpose, or will operate in an implementation. Texas Instruments and/or its licensors do not warrant that the design is production worthy. You should completely validate and test your design implementation to confirm the system functionality for your application.
- Engineer:
- Contact:
- © Texas Instruments
- (in symbol CMP-0073533-3, part A) A
- (in symbol CMP-0073533-3, part B) B

### Library data of the parts
C46 C69 = CMP-0007077-5: as C45 on sheet TIDA-010954-Power; Supplier Part Number 2: 79Y4100; Publisher: Texas Instruments; Supplier 2: Newark; Supplier Part Number 3: 810-CGA3E2X7R1E104K; TempCo: X7R; Supplier 3: Mouser; Published: 2008-06-19; RoHS: Y; MountType: SMT; Supplier 1: Digi-Key; PackageReference: 0603; Tolerance_%: 10%; Cap_Case: 0603; CompType: Capacitor; LatestRevisionDate: 2017-03-09; PartNumber: CGA3E2X7R1E104K080AA; VDC_V: 25V; ComponentLink1Description: Datasheet link; AEC Grade: 1; Supplier Part Number 1: 445-5667-1-ND; Technology: Ceramic; ValueDisplayed: 0.1uF; ComponentLink1URL: https://product.tdk.com/info/en/documents/chara_sheet/CGA3E2X7R1E104K080AA.pdf
C73 = CMP-0008959-2: as C102 on sheet TIDA-010954-Power; Supplier Part Number 2: 81-GRM31CR71A226K15L; Publisher: Texas Instruments; Supplier 2: Mouser; Supplier Part Number 3: 1797016; TempCo: X7R; Supplier 3: Farnell; Published: 2008-06-19; RoHS: Y; MountType: SMT; Supplier 1: Digi-Key; PackageReference: 1206; Tolerance_%: 10%; Value2: 10V; CompType: Capacitor; LatestRevisionDate: 2017-03-09; PartNumber: GRM31CR71A226KE15L; AEC Qualified: ?; ComponentLink1Description: Datasheet link; Supplier Part Number 1: 490-5309-1-ND; Technology: Ceramic; ComponentLink1URL: http://search.murata.co.jp/Ceramy/PnsearchViewAction.do?HnOFG=ON&HnNFG=ON&SEL_CNT=50&sLang=en&sKey=GRM31CR71A226KE15L&x=9&y=9&search=startwith
C97 C135 C137 = CMP-0007206-4: as C90 on sheet TIDA-010954-Input; Supplier Part Number 2: 81-GRM185C1H301JA01D; Publisher: Texas Instruments; Supplier 2: Mouser; TempCo: C0G/NP0; Published: 2008-06-19; RoHS: Y; MountType: SMT; Supplier 1: Digi-Key; PackageReference: 0603; Tolerance_%: 5%; Cap_Case: 0603; Value2: 50V; CompType: Capacitor; LatestRevisionDate: 2017-03-09; PartNumber: GRM1885C1H301JA01D; AEC Qualified: ?; Cap_F: 300pF; ComponentLink1Description: Datasheet link; Supplier Part Number 1: 490-1438-1-ND; Technology: Ceramic; ComponentLink1URL: http://search.murata.co.jp/Ceramy/PnsearchViewAction.do?HnOFG=ON&HnNFG=ON&SEL_CNT=50&sLang=en&sKey=GRM1885C1H301JA01D&x=9&y=9&search=startwith
C128-C131 = CMP-0009613-2: CAP, CERM, 2200 pF, 300 V, +/- 20%, E, TH, 2- Leads, Body 9x7mm, Pin Spacing 7.5mm; Manufacturer: MuRata; TaMin_C: -40°C; Polarized: N; SizeAreaWB_mm2: 99; Value1: Unknown; U/M: EA; Value: 2200pF; TaMax_C: 125°C; SizeZ_mm: 12; SizeX_mm: 9; SizeY_mm: 7; Cap_Case: 9x7x9mm; SizeArea_mm2: 63; Cap_F: 2.2nF; AEC Category: Q200; Supplier Part Number 2: 81-DE6E3KJ222MN3A; Publisher: Texas Instruments; Supplier 2: Mouser; TempCo: E; Published: 2008-06-19; RoHS: Y; MountType: TH; Supplier 1: Digi-Key; PackageReference: TH, 2- Leads, Body 9x7mm, Pin Spacing 7.5mm; Tolerance_%: 20%; Value2: 300V; CompType: Capacitor; LatestRevisionDate: 2017-03-09; PartNumber: DE6E3KJ222MN3A; AEC Qualified: ?; ComponentLink1Description: Datasheet link; Supplier Part Number 1: DE6E3KJ222MN3A-ND; Technology: Ceramic; ComponentLink1URL: http://psearch.murata.com/capacitor/product/DE6E3KJ222MN3A.pdf
C132 = CMP-0118136-1: WCAP-FTX2 Film Capacitor, THT, L18 x W8.5 x H14.5mm, 330nF, 275V; Manufacturer: Wurth Elektronik; Capacitance Tolerance: +/-10%; Dissipation Factor @100kHz: 2%; Dissipation Factor @10kHz: 0.2%; Dissipation Factor @1kHz: 0.1%; Insulation Resistance: 30000MOhm; Pitch: 15mm; Rate of Voltage Rise: 260V/us; Technical Reference: MX2P015334K275ACPP46004; Design Item ID: 890324025034CS; Category: Film Capacitors; Component Type: Standard; Height: 14.5mm; Length: 18mm; Manufacturer Part Number: 890324025034CS; Match Code: WCAP-FTX2; Mount: Through Hole; Operating Temperature Max: 105°C; Operating Temperature Min: -40°C; Packaging: Carton; Pin Count: 2; Rated Voltage (AC): 275V; Source: Film Capacitors.SchLib; Width: 8.5mm; ComponentLink1Description: Website Link; ComponentLink1URL: https://www.we-online.com/redexpert/article/890324025034CS?ad; ComponentLink2Description: Datasheet Link; ComponentLink2URL: https://www.we-online.com/redexpert/spec/890324025034CS?ad; PartNumber: 890324025034CS
C134 C136 = CMP-0007225-4: as C91 on sheet TIDA-010954-Input; Supplier Part Number 2: 81-GRM39C561J50; Publisher: Texas Instruments; Supplier 2: Mouser; Supplier Part Number 3: 1828912; TempCo: C0G/NP0; Supplier 3: Farnell; Published: 2008-06-19; RoHS: Y; MountType: SMT; Supplier 1: Digi-Key; PackageReference: 0603; Tolerance_%: 5%; Cap_Case: 0603; Value2: 50V; CompType: Capacitor; LatestRevisionDate: 2017-03-09; PartNumber: GRM1885C1H561JA01D; AEC Qualified: ?; Cap_F: 560pF; ComponentLink1Description: Datasheet link; Supplier Part Number 1: 490-1445-1-ND; Technology: Ceramic; ComponentLink1URL: http://search.murata.co.jp/Ceramy/PnsearchViewAction.do?HnOFG=ON&HnNFG=ON&SEL_CNT=50&sLang=en&sKey=GRM1885C1H561JA01D&x=9&y=9&search=startwith
F1 F2 = CMP-0123009-1: 6.3 A 300 V AC DC Fuse Board Mount (Cartridge Style Excluded) Through Hole Radial, Box; Manufacturer: Littelfuse Inc; Interrupt_AC: 50A; MeltingTyp: 160.74A2Sec; SizeZ_mm: 8mm; VAC_V: 300V; Fuse Speed: Slow; AEC Qualified: No; Fuse Current: 6.3A; Fuse Voltage Drop: 65mV; Res_ohm: 0.0077Ω; Standoff Height: 0.5mm; PackageReference: RADIAL; PartNumber: 36916300000; RoHS: TRUE; Supplier 1: Digikey; Supplier 2: Mouser; Supplier Part Number 1: F5465CT-ND; Supplier Part Number 2: 576-36916300000; VDC_V: 300V; Part Number: 36916300000; datasheet: https://www.littelfuse.com/media?resourcetype=datasheets&itemid=2d4d6025-892d-4199-9612-78de96bc2dfe&filename=littelfuse-fuse-369-datasheet; Datasheet Date: 2023-06-01; Datasheet Path: datasheets/Fuse-36916300000.pdf; Datasheet Version: GD; Digikey Description: FUSE BOARD MNT 6.3A 300VAC RAD; Digikey Part Number: F5465CT-ND; Fuse I2T: 160.74A2Sec; helpURL: https://upverter.com/upn/revision/4938207360b7b692/; Lead Free: Yes; Mouser Description: Fuses with Leads (Through Hole) 300V TL TE5 LL 6.3A; Mouser Part Number: 576-36916300000; Operating Temperature Range: -40°C to +85°C; ComponentLink1Description: Datasheet; ComponentLink1URL: https://www.littelfuse.com/media?resourcetype=datasheets&itemid=2d4d6025-892d-4199-9612-78de96bc2dfe&filename=littelfuse-fuse-369-datasheet
L8 L10 = CMP-0095148-1: 22 µH Shielded Wirewound Inductor 6 A 24.7mOhm Nonstandard; Manufacturer: Wurth Electronics; Self Resonant Frequency: 14MHz; TaMin_C: -40°C; AEC Grade: Grade 1; Irms: 6A; Value: 22uH; DCR_ohm: 27.17m; AEC Qualified: Yes; TaMax_C: +105°C; Test Frequency: 100kHz; Shrouded: true; SizeZ_mm: 6.5mm; Isat: 3A; Ind_H: 22µH; Tolerance_%: 20%; PartNumber: 7443551221; datasheet: https://www.we-online.com/catalog/datasheet/7443551221.pdf; Supplier Part Number 2: 710-7443551221; Supplier 1: Digikey; Technology: Wirewound; RoHS: TRUE; helpURL: https://upverter.com/upn/revision/b15f86e6b6b9e262/; PackageReference: SMD_IND_12MM8_12MM8; Operating Temperature Range: -40°C to +155°C; Part Number: 7443551221; Supplier 2: Mouser; ComponentLink1Description: Datasheet; Supplier Part Number 1: 732-2183-1-ND; Digikey Description: FIXED IND 22UH 6A 24.7 MOHM SMD; Mouser Part Number: 710-7443551221; Datasheet Path: datasheets/Ind-7443551221.pdf; Digikey Part Number: 732-2183-1-ND; ComponentLink1URL: https://www.we-online.com/catalog/datasheet/7443551221.pdf; Lead Free: Yes
L9 = CMP-0094060-1: 2.5 mH @ 10 kHz 2 Line Common Mode Choke Through Hole 5A DCR 15mOhm; Manufacturer: Wurth Electronics; Ind_H: 2.5mH; DCR_ohm: 15m; SizeZ_mm: 22mm; Tolerance_%: +50/-30%; Test Frequency: 10kHz; AEC Qualified: No; Supplier 1: Digikey; Mouser Part Number: 710-7448025003; Digikey Description: CMC 2.5MH 5A 2LN TH; Supplier 2: Mouser; Datasheet Path: datasheets/Ind-7448025003.pdf; Imax_A: 5A; RoHS: TRUE; Lead Free: Yes; ComponentLink1Description: Datasheet; Operating Temperature Range: -40°C to +125°C; PackageReference: PTH_COMMON_CHOKE; Supplier Part Number 2: 710-7448025003; datasheet: https://www.we-online.com/katalog/datasheet/7448025003.pdf; ComponentLink1URL: https://www.we-online.com/katalog/datasheet/7448025003.pdf; Part Number: 7448025003; Digikey Part Number: 732-13592-ND; PartNumber: 7448025003; helpURL: https://upverter.com/upn/revision/9352e13fa7a1c14b/; Supplier Part Number 1: 732-13592-ND
R38 R97 R105-R110 R112-R117 = CMP-0122928-1: 499 kOhms ±0.5% 0.667W, 2/3W Chip Resistor 1206 (3216 Metric) Automotive AEC-Q200, Pulse Withstanding Thick Film; Manufacturer: Panasonic; AEC Grade: Grade 0; AEC Qualified: Yes; Power_W: 660mW; SizeZ_mm: 0.7mm; TempCo: 100ppm/°C; VDC_V: 500V; PackageReference: 1206; PartNumber: ERJP08D4993V; Res_ohm: 499k; RoHS: TRUE; Supplier 1: Digikey; Supplier 2: Mouser; Supplier Part Number 1: ERJ-P08D4993V-ND; Supplier Part Number 2: 667-ERJ-P08D4993V; Technology: Thick Film; Tolerance_%: 0.5%; Part Number: ERJP08D4993V; datasheet: https://api.pim.na.industrial.panasonic.com/file_stream/main/fileversion/1088; Datasheet Path: datasheets/Res-ERJP08D4993V.pdf; Digikey Description: RES SMD 499 KOHM 0.5% 2/3W 1206; Digikey Part Number: ERJ-P08D4993V-ND; helpURL: https://upverter.com/upn/revision/54f8c178e3016f2a/; Lead Free: Yes; Mouser Description: Thick Film Resistors - SMD 1206 499Kohms 0.66W 0.5% AEC-Q200; Mouser Part Number: 667-ERJ-P08D4993V; Operating Temperature Range: -55°C to +155°C; Series: ERJ; ComponentLink1Description: Datasheet; ComponentLink1URL: https://api.pim.na.industrial.panasonic.com/file_stream/main/fileversion/1088
R95 R96 R99 = CMP-0097027-1: 3 kA Varistor 1 Circuit Through Hole Disc 13.2mm; Manufacturer: Bourns; VDC_V: 350V; Vc: 50A; Cap_F: 30pF; AEC Qualified: No; Clamping Voltage: 730V; SizeZ_mm: 19mm; PackageReference: RADIAL; Datasheet Path: datasheets/Res-IsoM3-275-B-L2.pdf; datasheet: https://www.bourns.com/docs/product-datasheets/isomov.pdf; Operating Temperature Range: -40°C to +125°C; Digikey Part Number: 118-ISOM3-275-B-L2-ND; helpURL: https://upverter.com/upn/revision/432fc44c5de15415/; PartNumber: IsoM3-275-B-L2; ValueDisplayed: 30pF; Part Number: IsoM3-275-B-L2; Mouser Part Number: 652-ISOM3-275-B-L2; RoHS: TRUE; ComponentLink1URL: https://www.bourns.com/docs/product-datasheets/isomov.pdf; Digikey Description: ISOMOV 3KA 275VRMS BULK IN-LINE; Lead Free: Yes; ComponentLink1Description: Datasheet
R101 R119 = CMP-0023013-5: as R46 on sheet TIDA-010954-Input; Supplier Part Number 2: 603-RC0603FR-07300RL; Supplier 2: Mouser; Supplier Part Number 3: 1799340; Supplier 3: Farnell; RoHS: Y; Value1: 1%; MountType: SMT; Supplier 1: Digi-Key; PackageReference: 0603; Tolerance_%: 1%; Res_ohm: 300; CompType: Resistor; PartNumber: RC0603FR-07300RL; ComponentLink1Description: Datasheet link; Supplier Part Number 1: 311-300HRCT-ND; Technology: Thick Film; ComponentLink1URL: http://www.yageo.com/pdf/Pu-RC0603_51_PbFree_L_2.pdf; AEC Grade: N/A
R102 = CMP-0022895-5: RES, 1.00 k, 1%, 0.1 W, 0603; Manufacturer: Yageo; Power_W: 100mW; TempCo: 100 ppm/C; Value_Code: 1k00; Value: 1.00k; EIA_Code: E96; Res_ohm: 1k; SizeX_mm: 1.6; SizeY_mm: 0.8; SizeZ_mm: 1; Value2: 0.1W; SizeArea_mm2: 1.28; AEC Qualified: N; VDC_V: 75V; AEC Category: Q200; SizeAreaWB_mm2: 4.68; Supplier Part Number 2: 603-RC0603FR-071KL; Supplier 2: Mouser; Supplier Part Number 3: 9238484; Supplier 3: Farnell; RoHS: Y; Value1: 1%; MountType: SMT; Supplier 1: Digi-Key; PackageReference: 0603; Tolerance_%: 1%; CompType: Resistor; PartNumber: RC0603FR-071KL; ComponentLink1Description: Datasheet link; Supplier Part Number 1: 311-1.00KHRCT-ND; Technology: Thick Film; ComponentLink1URL: http://www.yageo.com/pdf/Pu-RC0603_51_PbFree_L_2.pdf; AEC Grade: N/A
R103 = CMP-0023203-5: RES, 5.60 k, 1%, 0.1 W, 0603; Manufacturer: Yageo; Power_W: 100mW; TempCo: 100 ppm/C; Value_Code: 5k60; Value: 5.60k; Res_ohm: 5.6k; SizeX_mm: 1.6; SizeY_mm: 0.8; SizeZ_mm: 1; Value2: 0.1W; SizeArea_mm2: 1.28; AEC Qualified: N; VDC_V: 75V; AEC Category: Q200; SizeAreaWB_mm2: 4.68; Supplier Part Number 2: 603-RC0603FR-075K6L; Supplier 2: Mouser; Supplier Part Number 3: 9238573; Supplier 3: Farnell; RoHS: Y; Value1: 1%; MountType: SMT; Supplier 1: Digi-Key; PackageReference: 0603; Tolerance_%: 1%; CompType: Resistor; PartNumber: RC0603FR-075K6L; ComponentLink1Description: Datasheet link; Supplier Part Number 1: 311-5.60KHRCT-ND; Technology: Thick Film; ComponentLink1URL: http://www.yageo.com/pdf/Pu-RC0603_51_PbFree_L_2.pdf; AEC Grade: N/A
R104 R118 = CMP-0023710-3: RES, 12.0 k, 0.1%, 0.1 W, 0603; Manufacturer: Yageo America; Power_W: 100mW; TempCo: 25 ppm/C; Value_Code: 12k0; U/M: EA; Value: 12.0k; EIA_Code: E192; Res_ohm: 12k; SizeX_mm: 1.6; SizeY_mm: 0.8; SizeZ_mm: 1; Value2: 0.1W; SizeArea_mm2: 1.28; VDC_V: 75V; AEC Category: Q200; Publisher: Texas Instruments; RoHS: Y; Value1: 0.1%; MountType: SMT; PackageReference: 0603; Tolerance_%: 0.1%; CompType: Resistor; LatestRevisionDate: 2017-03-09; PartNumber: RT0603BRD0712KL; AEC Qualified: ?; ComponentLink1Description: Datasheet link; Technology: Thin Film; Published: 2008-06-26; ComponentLink1URL: http://www.yageo.com/pdf/PYu-RT_1-to-0.05_RoHS_L_3.pdf
R111 = CMP-0023169-5: RES, 51.0, 1%, 0.1 W, 0603; Manufacturer: Yageo; Power_W: 100mW; TempCo: 100 ppm/C; Value_Code: 51R0; Value: 51.0; Res_ohm: 51; SizeX_mm: 1.6; SizeY_mm: 0.8; SizeZ_mm: 1; Value2: 0.1W; SizeArea_mm2: 1.28; AEC Qualified: N; VDC_V: 75V; AEC Category: Q200; SizeAreaWB_mm2: 4.68; Supplier Part Number 2: 603-RC0603FR-0751RL; Supplier 2: Mouser; Supplier Part Number 3: 1799350; Supplier 3: Farnell; RoHS: Y; Value1: 1%; Supplier 1: Digi-Key; PackageReference: 0603; Tolerance_%: 1%; CompType: Resistor; PartNumber: RC0603FR-0751RL; ComponentLink1Description: Datasheet link; Supplier Part Number 1: 311-51.0HRCT-ND; Technology: Thick Film; MountType: SMT; ComponentLink1URL: http://www.yageo.com/pdf/Pu-RC0603_51_PbFree_L_2.pdf; AEC Grade: N/A
TP6 TP11 TP15 = CMP-0055148-2: as TP4 on sheet TIDA-010954-Top; ComponentLink1Description: Datasheet URL; Supplier 1: Digi-Key; MountType: TH; Supplier 2: Mouser; LatestRevisionDate: 26/05/2017; Publisher: Texas Instruments; PartNumber: 5011; Color: Black; ComponentLink1URL: http://www.keyelco.com/userAssets/file/M60-2p60.pdf; Green_EU RoHS-2: Incomplete; Supplier Part Number 1: 36-5011-ND; Supplier Part Number 2: 534-5011; Green_EU RoHS: Passed; RoHS: Y; PackageReference: Black Multipurpose Testpoint; CompType: Test Point
U14 = CMP-0096055-1: Manufacturer: Texas Instruments; Standoff Height: 0.1mm; SizeZ_mm: 2.65mm; RoHS: UNKNOWN; PackageReference: SOICW10; PartNumber: TMCS1123B5QDVGR; Operating Temperature Range: to; Part Number: TMCS1123B5QDVGR; Datasheet Path: datasheets/IC-TMCS1123B5QDVGR.pdf; helpURL: https://upverter.com/upn/revision/3eedce7f3e37160e/
U15 = CMP-0073533-3: 350 kHz, Low-Noise, RRIO, CMOS Operational Amplifier for Cost-Sensitive Systems, DGK0008A (VSSOP-8); Alternate PartNumber: TLV2333IDGKT; Alternate Manufacturer: Texas Instruments; SizeAreaWB_mm2: 23.6; SizeZ_mm: 1.1; SizeX_mm: 4.9; SizeY_mm: 3; SizeArea_mm2: 14.7; CompType: IC; AEC Category: Q200; AEC Qualified: N; ComponentLink1URL: http://www.ti.com/lit/ds/symlink/tlv2333.pdf; PackageDescription: VSSOP-8; RoHS: Y; MountType: SMT; Manufacturer: Texas Instruments; PackageReference: DGK0008A; PartNumber: TLV9002IDGKR; ComponentLink1Description: Datasheet Link; ComponentLink2Description: Product Folder; ComponentLink2URL: http://www.ti.com/product/tlv2333; ComponentLink3Description: Online Datasheet; ComponentLink3URL: http://www.ti.com/product/tlv2333/datasheet; Code_JEDEC: MO-187-AA
U16 = CMP-0085634-1: 3.6V Data-Line Surge and 30kV ESD Protection Diode Array, DBV0005A (SOT-23-5); Alternate Manufacturer: Texas Instruments; SizeX_mm: 2.8; SizeArea_mm2: 8.12; Rating: Catalog; SizeAreaWB_mm2: 14.82; AEC Category: Q200; AEC Qualified: N; CompType: IC; SizeZ_mm: 1.45; SizeY_mm: 2.9; ComponentLink3URL: http://www.ti.com/product/esds312/datasheet; PackageDescription: SOT-23-5; RoHS: Y; ComponentLink1Description: Datasheet Link; Operating Temperature Range: -40 to 125 C; PackageReference: DBV0005A; ComponentLink1URL: http://www.ti.com/lit/ds/symlink/esds312.pdf; ComponentLink3Description: Online Datasheet; MountType: SMT; ComponentLink2URL: http://www.ti.com/product/esds312; PartNumber: ESDS312DBVR; Manufacturer: Texas Instruments; ComponentLink2Description: Product Folder